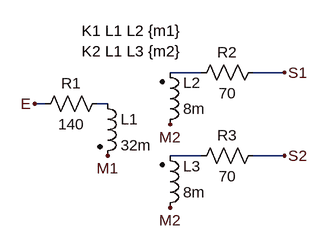
[diagram p0: schematic inductance_mutuelle.asc]
inductance_mutuelle.asc, the LTspice schematic file:
Version 4
SHEET 1 880 680
WIRE 272 48 224 48
WIRE 400 48 352 48
WIRE 32 96 16 96
WIRE 128 96 112 96
WIRE 272 176 224 176
WIRE 400 176 352 176
FLAG 16 96 E
FLAG 400 48 S1
FLAG 400 176 S2
FLAG 128 176 M1
FLAG 224 128 M2
FLAG 224 256 M2
SYMBOL ind2 112 80 R0
SYMATTR InstName L1
SYMATTR Value 32m
SYMATTR Type ind
SYMBOL ind2 208 144 M180
WINDOW 0 36 80 Left 2
WINDOW 3 36 40 Left 2
SYMATTR InstName L2
SYMATTR Value 8m
SYMATTR Type ind
SYMBOL ind2 208 272 M180
WINDOW 0 36 80 Left 2
WINDOW 3 36 40 Left 2
SYMATTR InstName L3
SYMATTR Value 8m
SYMATTR Type ind
SYMBOL res 16 112 R270
WINDOW 0 32 56 VTop 2
WINDOW 3 0 56 VBottom 2
SYMATTR InstName R1
SYMATTR Value 140
SYMBOL res 256 64 R270
WINDOW 0 32 56 VTop 2
WINDOW 3 0 56 VBottom 2
SYMATTR InstName R2
SYMATTR Value 70
SYMBOL res 256 192 R270
WINDOW 0 32 56 VTop 2
WINDOW 3 0 56 VBottom 2
SYMATTR InstName R3
SYMATTR Value 70
TEXT 88 -16 Left 2 !K1 L1 L2 {m1}\nK2 L1 L3 {m2}

The netlist it stands for:
* inductance_mutuelle.asc
L1 N002 M1 32m
L2 M2 N001 8m
L3 M2 N003 8m
R1 E N002 140
R2 N001 S1 70
R3 N003 S2 70
K1 L1 L2 {m1}
K2 L1 L3 {m2}
.backanno
.end